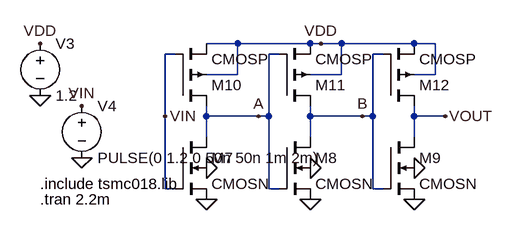
[diagram p0: schematic fo4_delay.asc]
fo4_delay.asc, the LTspice schematic file:
Version 4
SHEET 1 880 680
WIRE 224 -288 176 -288
WIRE 336 -288 224 -288
WIRE 352 -288 336 -288
WIRE 384 -288 352 -288
WIRE 496 -288 384 -288
WIRE 528 -288 496 -288
WIRE 128 -272 112 -272
WIRE 288 -272 272 -272
WIRE 448 -272 432 -272
WIRE 224 -240 224 -288
WIRE 224 -240 176 -240
WIRE 384 -240 384 -288
WIRE 384 -240 336 -240
WIRE 528 -240 528 -288
WIRE 528 -240 496 -240
WIRE 112 -176 112 -272
WIRE 176 -176 176 -192
WIRE 256 -176 176 -176
WIRE 272 -176 272 -272
WIRE 272 -176 256 -176
WIRE 336 -176 336 -192
WIRE 416 -176 336 -176
WIRE 432 -176 432 -272
WIRE 432 -176 416 -176
WIRE 496 -176 496 -192
WIRE 544 -176 496 -176
WIRE 176 -144 176 -176
WIRE 336 -144 336 -176
WIRE 496 -144 496 -176
WIRE 112 -64 112 -176
WIRE 128 -64 112 -64
WIRE 272 -64 272 -176
WIRE 288 -64 272 -64
WIRE 432 -64 432 -176
WIRE 448 -64 432 -64
FLAG 176 -48 0
FLAG 336 -48 0
FLAG 496 -48 0
FLAG 336 -96 0
FLAG 176 -96 0
FLAG 496 -96 0
FLAG 352 -288 VDD
FLAG 544 -176 VOUT
FLAG 256 -176 A
FLAG 416 -176 B
FLAG 112 -176 VIN
FLAG -80 -288 VDD
FLAG -16 -192 VIN
FLAG -16 -112 0
FLAG -80 -208 0
SYMBOL cmosn 128 -144 R0
SYMATTR InstName M7
SYMATTR Value2 l=180n w=2u
SYMBOL cmosn 288 -144 R0
SYMATTR InstName M8
SYMATTR Value2 l=180n w=4u
SYMBOL cmosn 448 -144 R0
SYMATTR InstName M9
SYMATTR Value2 l=180n w=8u
SYMBOL cmosp 128 -192 M180
SYMATTR InstName M10
SYMATTR Value2 l=180n w=10u
SYMBOL cmosp 288 -192 M180
SYMATTR InstName M11
SYMATTR Value2 l=180n w=20u
SYMBOL cmosp 448 -192 M180
SYMATTR InstName M12
SYMATTR Value2 l=180n w=40u
SYMBOL voltage -80 -304 R0
WINDOW 123 0 0 Left 0
WINDOW 39 0 0 Left 0
SYMATTR InstName V3
SYMATTR Value 1.2
SYMBOL voltage -16 -208 R0
WINDOW 123 0 0 Left 0
WINDOW 39 0 0 Left 0
SYMATTR InstName V4
SYMATTR Value PULSE(0 1.2 0 50n 50n 1m 2m)
TEXT -80 -72 Left 2 !.include tsmc018.lib
TEXT -80 -48 Left 2 !.tran 2.2m

The netlist it stands for:
* fo4_delay.asc
M7 A VIN 0 0 CMOSN l=180n w=2u
M8 B A 0 0 CMOSN l=180n w=4u
M9 VOUT B 0 0 CMOSN l=180n w=8u
M10 A VIN VDD VDD CMOSP l=180n w=10u
M11 B A VDD VDD CMOSP l=180n w=20u
M12 VOUT B VDD VDD CMOSP l=180n w=40u
V3 VDD 0 1.2
V4 VIN 0 PULSE(0 1.2 0 50n 50n 1m 2m)
.model NMOS NMOS
.model PMOS PMOS
.lib standard.mos
.include tsmc018.lib
.tran 2.2m
.backanno
.end

* Results of the author's LTspice run, read from the files saved beside the schematic
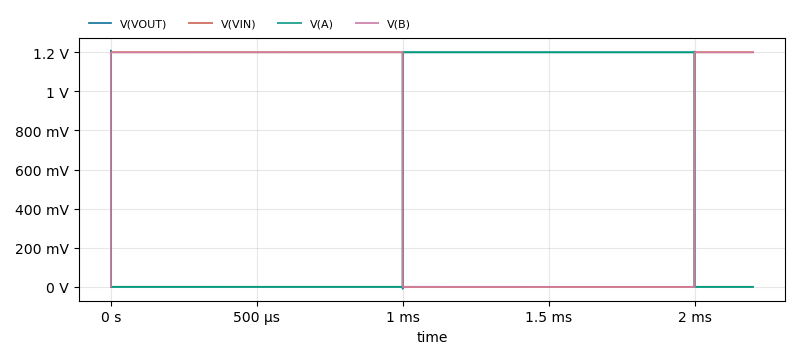
[diagram p1: Transient Analysis of fo4_delay.asc, plotted from the saved traces]
* Transient Analysis, 1 run:
*   V(VOUT): min -10.21 mV, max 1.21 V, average 545.4 mV, rms 809 mV, last 0 V
*   V(VIN): min 0 V, max 1.2 V, average 654.6 mV, rms 886.3 mV, last 1.2 V
*   V(A): min -109.7 µV, max 1.2 V, average 545.4 mV, rms 809 mV, last 0 V
*   V(B): min -1.243 mV, max 1.201 V, average 654.6 mV, rms 886.3 mV, last 1.2 V